# EasyEDA Pro project 可调电源.eprj, board PCB1
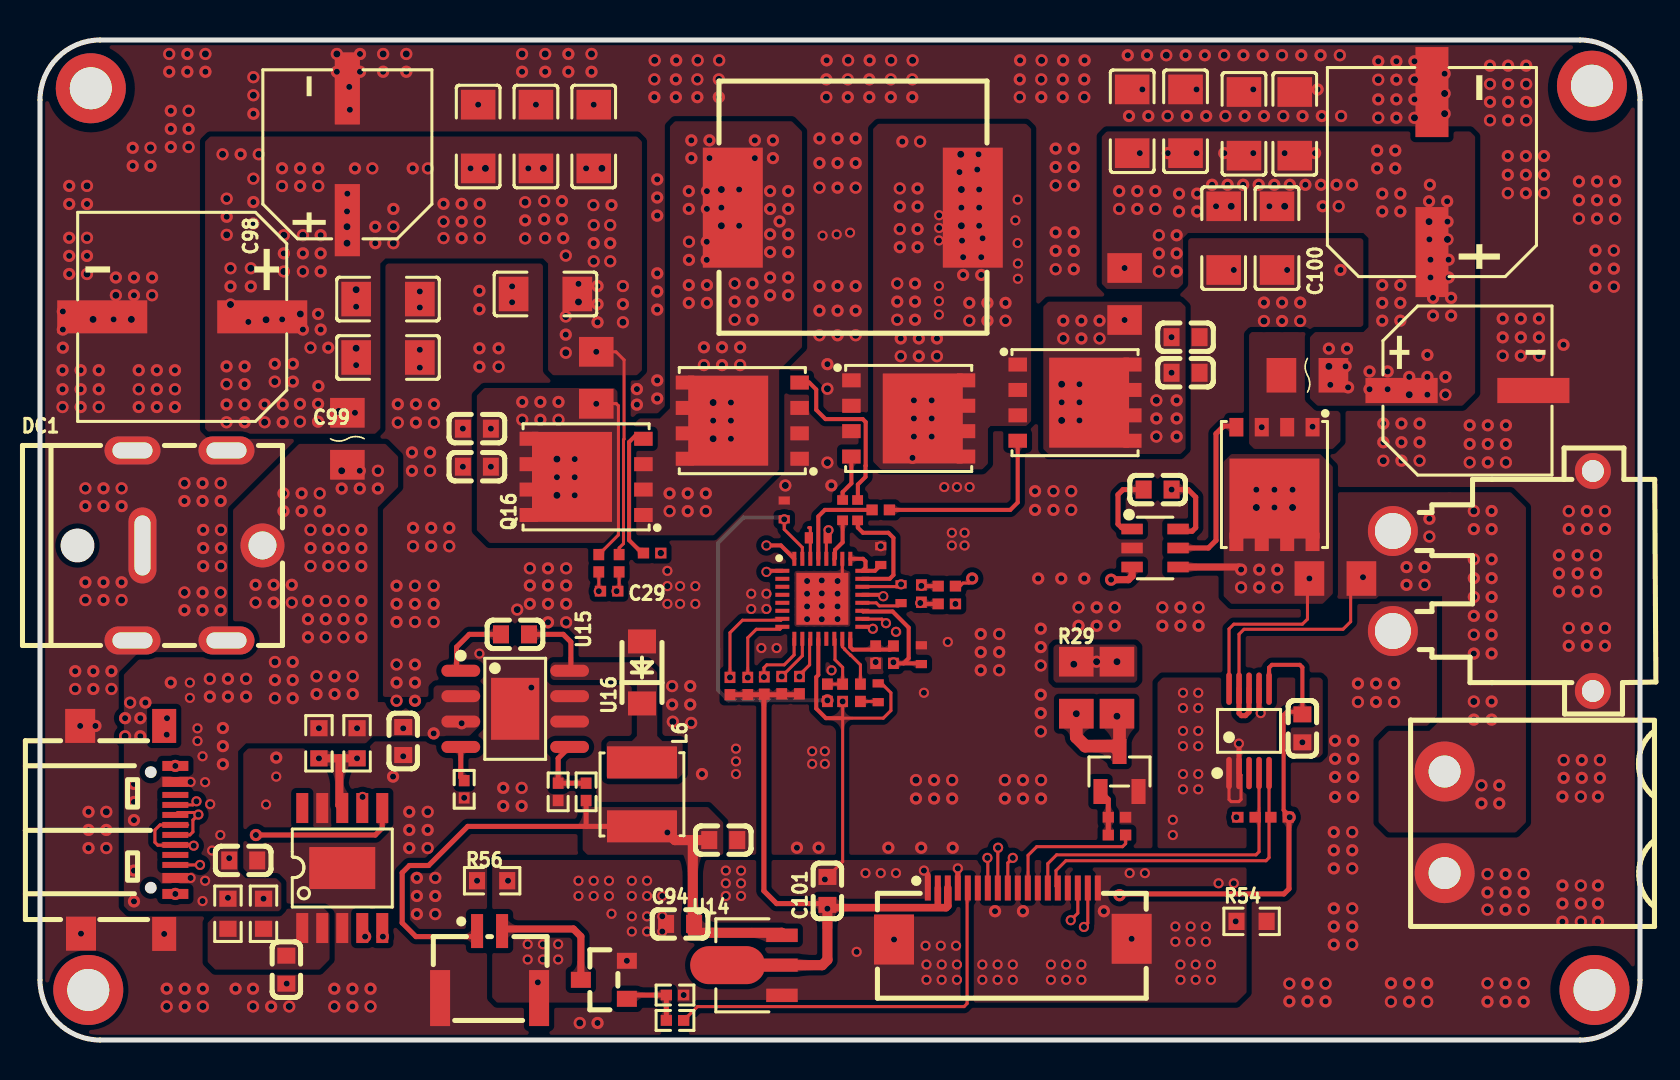
[diagram p2: board, top side]
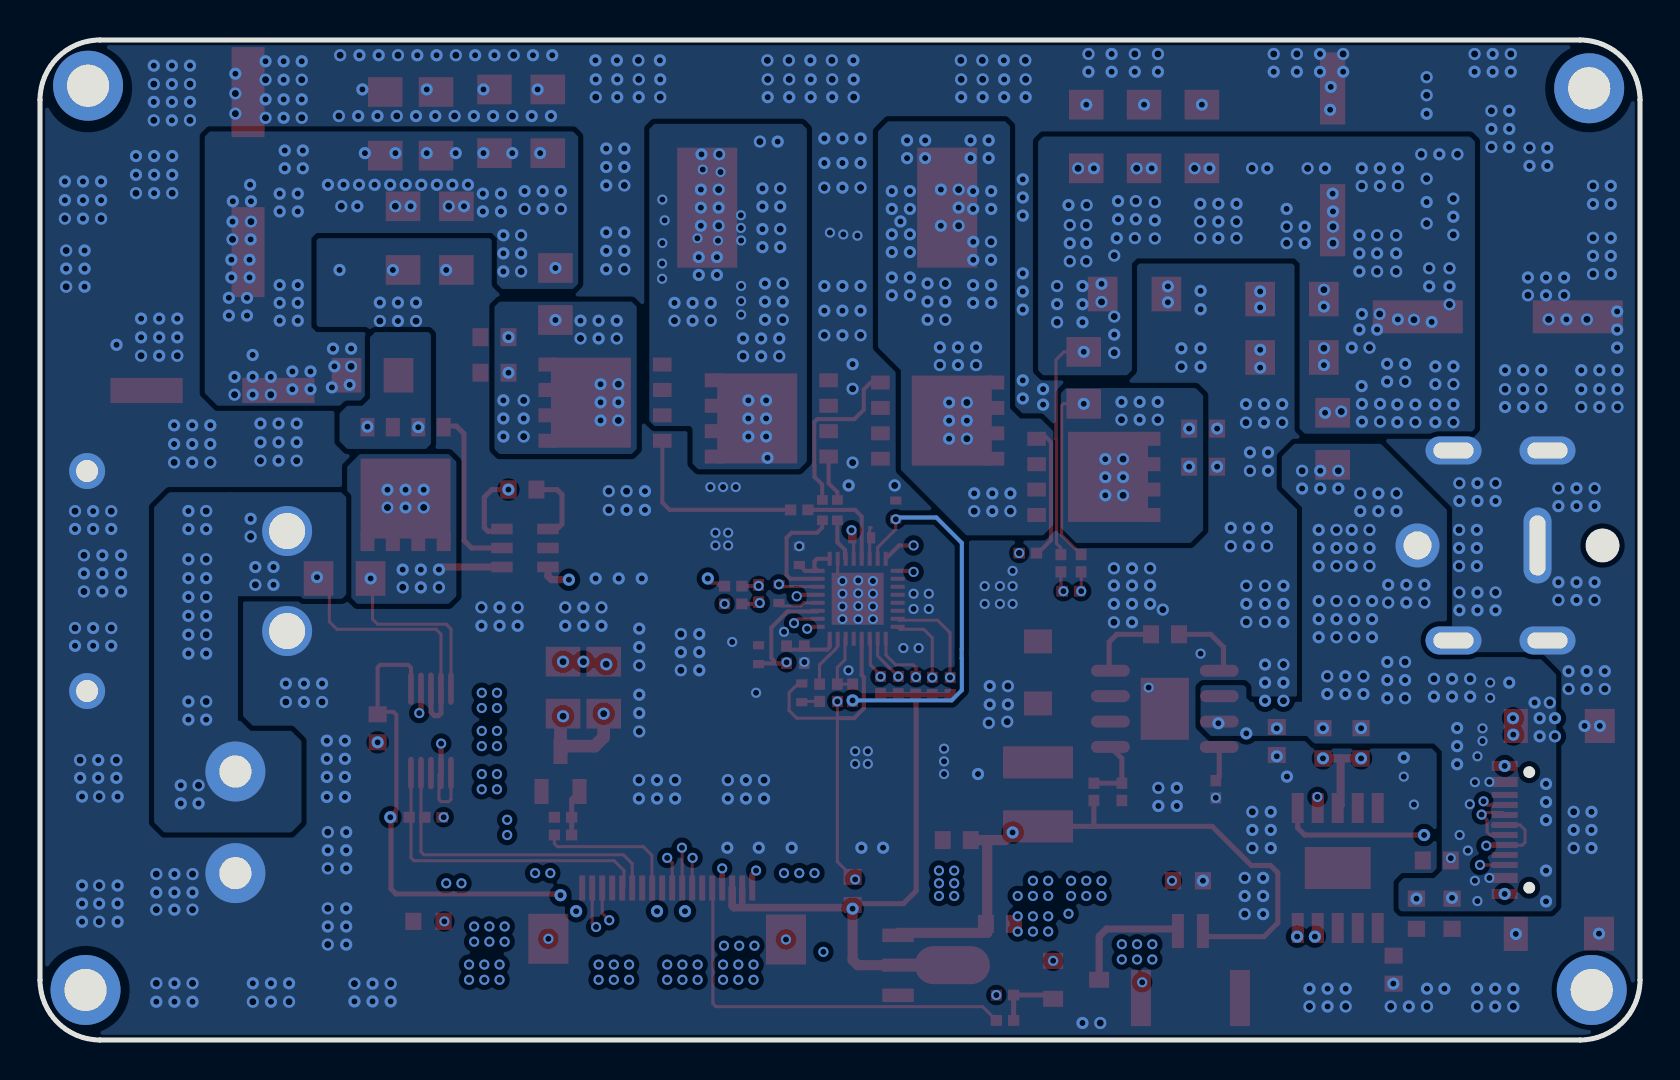
[diagram p3: board, bottom side, seen from below]

Outline 80 x 50 mm; copper layers: Top Layer, 内层1, 内层2, Bottom Layer. Coordinates in mm from the lower left corner of the outline.
Outline path: 0,47 0,3 arc(0.88,0.88) 3,0 77,0 arc(79.12,0.88) 80,3 80,47 arc(79.12,49.12) 77,50 3,50 arc(0.88,49.12) 0,47
Stack: Top Layer 0.035mm 外层铜厚1oz / Dielectric1 0.2104mm 7628 RC49% 8.6mil / 内层1 0.0152mm 内层铜厚 / Dielectric2 1.065mm 1.1mm H/HOZ Copper / 内层2 0.0152mm 内层铜厚 / Dielectric3 0.2104mm 7628 RC49% 8.6mil / Bottom Layer 0.035mm 外层铜厚1oz

## Design rules (mm)
template: 自定义配置
spacing copperThickness1oz (default): track to track 0.102, other pairs 0.152 to 0.3
spacing copperThickness2oz: track to track 0.203, other pairs 0.152 to 0.3
track width copperThickness1oz (default): min 0.127, default 0.254, max 2.54
track width copperThickness2oz: min 0.203, default 0.254, max 2.54
differential pair differentialPair (default): width min 0.127, default 0.254, max 2.54; gap min 0.152, default 0.152
via viaSize (default): diameter min 0.5, default 0.61, max 10; hole min 0.3, default 0.305, max 6.3

## Placement (name value [footprint] x y rotation side)
C28  100nF  [C0402]  44.07 22.31 90 top
C29  100nF  [C0402]  28.45 22.44 0 top
C49  22uF  [C1206]  60.2 45.81 270 top
C50  22uF  [C1206]  57.28 45.94 270 top
C51  22uF  [C1206]  62.74 45.81 270 top
C52  22uF  [C1206]  61.85 40.09 270 top
C53  22uF  [C1206]  59.18 40.09 270 top
C55  22uF  [C1206]  25.27 37.3 0 top
C56  22uF  [C1206]  17.4 34.12 180 top
C57  22uF  [C1206]  17.4 37.05 180 top
C58  22uF  [C1206]  24.8 45.17 90 top
C59  22uF  [C1206]  27.69 45.17 90 top
C60  22uF  [C1206]  21.91 45.17 90 top
C66  100uF  [CAP-SMD_BD8.0-L8.3-W8.3-LS9.0-FD]  71.37 32.47 0 top
C68  100nF  [C0603]  63.12 15.58 90 top
C69  100nF  [C0603]  12.32 3.52 90 top
C76  100nF  [C0603]  21.84 30.57 0 top
C77  100nF  [C0603]  21.84 28.66 0 top
C78  100nF  [C0603]  57.28 33.36 180 top
C79  100nF  [C0603]  57.28 35.14 180 top
C80  100nF  [C0402#2]  43.05 22.31 90 top
C81  1uF  [C0402#2]  44.07 19.27 90 top
C83  100nF  [C0402#2]  38.91 25.11 0 top
C84  22nf  [C0402#2]  41.91 17.36 270 top
C85  1uF  [C0402#2]  37.21 26.5 90 top
C87  100nF  [C0603]  55.88 27.52 180 top
C88  2.2uF  [C0402#2]  42.04 24.22 90 top
C91  22uF  [C1206]  54.61 45.94 270 top
C92  100nF  [C0603]  10.16 8.98 0 top
C94  1uf  [C0603]  32 5.8 0 top
C98  100uF  [CAP-SMD_BD8.0-L8.3-W8.3-LS9.0-FD]  15.37 44.28 90 top
C99  220uF  [CAP-SMD_BD10.0-L10.3-W10.3-FD-1]  7.11 36.16 180 top
C100  220uF  [CAP-SMD_BD10.0-L10.3-W10.3-FD-1]  69.6 43.4 90 top
C101  100nF  [C0603]  39.37 7.45 90 top
C102  4.7uF  [C0603]  18.16 14.95 90 top
C103  100nF  [C0603]  23.75 20.28 0 top
C104  10uF  [C0603]  34.16 10 180 top
CN1  XT30PW-M30.G.Y  [CONN-TH_XT30PW-M]  72.64 22.95 90 top
CN2  WAFER-GH1.25-2PLB  [CONN-TH_2P-P1.25_XUNPU_WAFER-GH1.25-2PLB]  22.48 3.77 0 top
CN3  WJ2EDGR-5.08-2P  [CONN-TH_WJ2EDGR-5.08-2P]  70.23 10.88 90 top
DC1  DC007B-2.5  [DC-IN-TH_HX-DC007B-2.5]  7.87 24.73 0 top
F1  1206C_63V_15A  [F1206]  63.37 33.24 0 top
F2  1206C_63V_15A  [F1206]  15.37 30.06 270 top
FPC1  FPC-05F-18PH20  [FPC-SMD_18P-P0.50_FPC-05F-18PH20]  48.64 6.31 0 top
L4  4.7uH  [IND-SMD_L13.45-W12.6]  40.64 41.62 180 top
L6  15uH  [IND-SMD_L4.0-W4.0]  30.1 12.28 270 top
NOREF  -  [Pad_e3715]  77.72 2.5 270 top
NOREF#2  -  [Pad_e104]  2.41 2.5 270 top
NOREF#3  -  [Pad_e103]  2.54 47.59 270 top
NOREF#4  -  [Pad_e2350]  77.6 47.71 270 top
Q13  -  [S8050_SOT-23]  28.19 2.88 0 top
Q15  AO3400A  [SOT-23-3_L2.9-W1.3-P1.90-LS2.4-BR]  53.97 13.42 270 top
Q16  AON6260  [PG-TDSON-8_L5.9-W5.2-P1.27-LS6.2-BL-EP]  27.31 28.16 90 top
Q17  AON6260  [PG-TDSON-8_L5.9-W5.2-P1.27-LS6.2-BL-EP]  35.12 30.97 90 top
Q18  AON6260  [PG-TDSON-8_L5.9-W5.2-P1.27-LS6.2-BL-EP]  43.43 31.08 270 top
Q19  AON6260  [PG-TDSON-8_L5.9-W5.2-P1.27-LS6.2-BL-EP]  51.75 31.87 270 top
Q21  AON6260  [PG-TDSON-8_L5.9-W5.2-P1.27-LS6.2-BL-EP]  61.72 27.78 180 top
R1  11.2K  [R0402#2]  21.21 12.53 90 top
R4  5mΩ  [R1206]  54.23 37.3 270 top
R5  5mΩ  [R1206]  27.81 33.11 90 top
R6  10Ω  [R0402#2]  45.34 21.81 0 top
R7  10Ω  [R0402#2]  45.34 22.69 0 top
R8  10Ω  [R0402#2]  27.94 23.84 90 top
R9  10Ω  [R0402#2]  28.96 23.84 90 top
R11  2Ω  [R0402#2]  42.04 26.5 180 top
R12  2Ω  [R0402#2]  30.61 24.35 180 top
R13  2Ω  [R0402]  40.13 26.5 270 top
R24  270kΩ  [R0402#2]  42.67 19.27 270 top
R26  10kΩ  [R0402#2]  41.02 17.36 90 top
R27  15kΩ  [R0402#2]  41.78 19.27 90 top
R28  100K  [R0402#2]  39.37 17.36 270 top
R29  300Ω  [R1206]  51.82 17.61 90 top
R30  300Ω  [R1206]  53.85 17.61 90 top
R31  5.6K  [R0402#2]  40.13 17.36 90 top
R33  5mΩ  [R1206]  64.77 23.08 180 top
R34  20K  [R0603]  13.95 14.84 270 top
R35  20K  [R0603]  15.85 14.84 270 top
R36  2K  [R0603]  9.4 6.31 90 top
R37  2K  [R0603]  11.18 6.31 90 top
R38  10K  [R0402#2]  34.5 17.7 270 top
R39  10K  [R0402#2]  35.39 17.7 270 top
R40  10K  [R0402#2]  36.22 17.72 270 top
R41  10K  [R0402#2]  37.97 17.74 270 top
R42  10K  [R0402#2]  37.08 17.74 270 top
R49  10K  [R0402#2]  53.85 11.14 180 top
R51  1K  [R0402#2]  53.85 10.25 0 top
R52  10K  [R0402#2]  31.75 2.25 0 top
R53  1K  [R0402#2]  31.75 0.98 180 top
R54  0R  [R0603]  60.58 5.93 0 top
R56  0R  [R0603]  22.61 7.96 180 top
R59  4.7K  [R0402#2]  60.32 11.14 0 top
R60  4.7K  [R0402#2]  61.98 11.14 180 top
R61  2Ω  [R0402]  40.89 26.48 90 top
R62  56K  [R0402#2]  27.31 12.41 270 top
R63  10K  [R0402#2]  25.91 12.41 90 top
U6  SC8815QDER  [QFN-32_L4.0-W4.0-P0.40-BL-EP2.7]  39.12 22.06 270 top
U8  INA226AIDGSR  [MSOP-10_L3.0-W3.0-P0.50-LS5.0-BL]  60.45 15.46 0 top
U9  CH224K  [ESSOP-10_L4.9-W3.9-P1.0-LS6.0-TL-EP]  15.11 8.6 0 top
U13  LM74700QDBVRQ1  [SOT-23-6_L2.9-W1.6-P0.95-LS2.8-BL]  55.75 24.6 270 top
U14  SCJA1117B-3.3-A  [SOT-89-3L_L4.5-W2.5-P1.50-LS4.1-BR]  35.74 3.73 0 top
U15  LMR16020PDDAR  [SOIC-8_L4.9-W3.9-P1.27-LS6.0-BL-EP]  23.76 16.56 270 top
U16  SS24FL  [SOD-123FL_L2.8-W1.8-LS3.6-RD]  30.1 18.38 90 top
USB1  TYPE-C 16P QTWT  [USB-TYPE-C-SMD_TYPE-C-16P-QTWT]  4.32 10.5 270 top

## Footprints (pads in the part's own frame, mm; a bottom-side part is the same pattern mirrored in y, then rotated)
C0402
  rect 0.566x0.54 smd: 1(-0.424,0) 2(0.441,0)
C0402#2
  rect 0.41x0.56 smd: 1(-0.47,0) 2(0.47,0)
C0603
  rect 0.8x0.9 smd: 1(-0.7,0) 2(0.7,0)
C1206
  rect 1.485x1.728 smd: 1(-1.593,0) 2(1.593,0)
CAP-SMD_BD8.0-L8.3-W8.3-LS9.0-FD
  rect 3.61x1.26 smd: 1(-3.295,0) 2(3.295,0)
CAP-SMD_BD10.0-L10.3-W10.3-FD-1
  rect 4.5x1.65 smd: 1(-4,0) 2(4,0)
CONN-TH_2P-P1.25_XUNPU_WAFER-GH1.25-2PLB
  rect 0.6x1.7 smd: 1(-0.625,1.675) 2(0.625,1.675)
  rect 1x2.8 smd: 3(2.475,-1.675) 4(-2.475,-1.675)
CONN-TH_WJ2EDGR-5.08-2P
  round 3 hole 1.6: 1(-2.54,0) 2(2.54,0)
CONN-TH_XT30PW-M
  round 2.5 hole 1.8: 1(-2.5,5) 2(2.5,5)
  round 1.8 hole 1.1: 3(5.5,-5) 4(-5.5,-5)
DC-IN-TH_HX-DC007B-2.5
  round 2.2 hole 1.4: 1(3.25,0)
  oval 1.4x3.8 hole 0.8x3: 2(-2.75,0)
  oval 2.8x1.4 hole 2x0.8: 3(-3.25,4.75) 3(-3.25,-4.75) 3(1.45,4.75) 3(1.45,-4.75)
ESSOP-10_L4.9-W3.9-P1.0-LS6.0-TL-EP
  rect 0.6x1.5 smd: 1(-2,-3) 2(-1,-3) 3(0,-3) 4(1,-3) 5(2,-3) 6(2,3) 7(1,3) 8(0,3) 9(-1,3) 10(-2,3)
  rect 3.3x2.1 smd: 11(0,0)
F1206
  rect 1.485x1.728 smd: 1(-1.3,0) 2(1.3,0)
FPC-SMD_18P-P0.50_FPC-05F-18PH20
  rect 0.3x1.25 smd: 1(-4.25,1.288) 2(-3.75,1.288) 3(-3.25,1.288) 4(-2.75,1.288) 5(-2.25,1.288) 6(-1.75,1.288) 7(-1.25,1.288) 8(-0.75,1.288) 9(-0.25,1.288) 10(0.25,1.288) 11(0.75,1.288) 12(1.25,1.288) 13(1.75,1.288) 14(2.25,1.288) 15(2.75,1.288) 16(3.25,1.288) 17(3.75,1.288) 18(4.25,1.288)
  rect 2x2.5 smd: 19(-5.94,-1.288) 20(5.94,-1.252)
IND-SMD_L4.0-W4.0
  rect 1.6x3.5 smd: 1(-1.6,0) 2(1.6,0)
IND-SMD_L13.45-W12.6
  rect 3x6 smd: 1(-6,0) 2(6,0)
MSOP-10_L3.0-W3.0-P0.50-LS5.0-BL
  oval 0.28x1.62 smd: 1(-1,-2.11) 2(-0.5,-2.11) 3(0,-2.11) 4(0.5,-2.11) 5(1,-2.11) 6(1,2.11) 7(0.5,2.11) 8(0,2.11) 9(-0.5,2.11) 10(-1,2.11)
Pad_e103
  round 3.5 hole 2.1: 1(0,0)
Pad_e104
  round 3.5 hole 2.1: 1(0,0)
Pad_e2350
  round 3.5 hole 2.1: 1(0,0)
Pad_e3715
  round 3.5 hole 2.1: 1(0,0)
PG-TDSON-8_L5.9-W5.2-P1.27-LS6.2-BL-EP
  rect 0.7x0.925 smd: 1(-1.905,-2.865) 2(-0.635,-2.865) 3(0.635,-2.865) 4(1.905,-2.865) 5(1.905,2.865) 6(0.635,2.865) 7(-0.635,2.865) 8(-1.905,2.865)
  rect 4.5x4 smd: 9(0.001,0.705)
QFN-32_L4.0-W4.0-P0.40-BL-EP2.7
  rect 0.2x0.7 smd: 1(-1.4,-2) 2(-1,-2) 3(-0.6,-2) 4(-0.2,-2) 5(0.2,-2) 6(0.6,-2) 7(1,-2) 8(1.4,-2) 17(1.4,2) 18(1,2) 19(0.6,2) 20(0.2,2) 21(-0.2,2) 22(-0.6,2) 23(-1,2) 24(-1.4,2)
  rect 0.7x0.2 smd: 9(2,-1.4) 10(2,-1) 11(2,-0.6) 12(2,-0.2) 13(2,0.2) 14(2,0.6) 15(2,1) 16(2,1.4) 25(-2,1.4) 26(-2,1) 27(-2,0.6) 28(-2,0.2) 29(-2,-0.2) 30(-2,-0.6) 31(-2,-1) 32(-2,-1.4)
  rect 2.6x2.6 smd: 33(0,0)
R0402
  rect 0.48x0.54 smd: 1(-0.495,0.013) 2(0.52,0.013)
R0402#2
  rect 0.566x0.54 smd: 1(-0.433,0) 2(0.433,0)
R0603
  rect 0.806x0.864 smd: 1(-0.753,0) 2(0.753,0)
R1206
  rect 1.485x1.728 smd: 1(-1.3,0) 2(1.3,0)
S8050_SOT-23
  rect 1x0.8 smd: 1(1.15,-0.823) 2(1.15,1.077) 3(-1.15,0.127)
SOD-123FL_L2.8-W1.8-LS3.6-RD
  rect 1.2x1.4 smd: 1(-1.55,0) 2(1.55,0)
SOIC-8_L4.9-W3.9-P1.27-LS6.0-BL-EP
  oval 0.602x1.941 smd: 1(-1.905,-2.72) 2(-0.635,-2.72) 3(0.635,-2.72) 4(1.905,-2.72) 5(1.905,2.72) 6(0.635,2.72) 7(-0.635,2.72) 8(-1.905,2.72)
  rect 3.098x2.41 smd: 9(0,0)
SOT-23-3_L2.9-W1.3-P1.90-LS2.4-BR
  rect 1.25x0.7 smd: 1(1,-0.95) 2(1,0.95) 3(-1,0)
SOT-23-6_L2.9-W1.6-P0.95-LS2.8-BL
  rect 0.532x1.072 smd: 1(-0.95,-1.149) 2(0,-1.149) 3(0.95,-1.149) 4(0.95,1.149) 5(0,1.149) 6(-0.95,1.149)
SOT-89-3L_L4.5-W2.5-P1.50-LS4.1-BR
  rect 1.575x0.672 smd: 1(1.356,-1.5) 3(1.356,1.5)
  custom 5.377x1.9 smd: 2(-1.356,0.009)
USB-TYPE-C-SMD_TYPE-C-16P-QTWT
  rect 1.7x1.2 smd: 0(-5.2,1.891) 0(5.2,1.891)
  rect 1.7x1.5 smd: 0(-5.2,-2.309) 0(5.185,-2.268)
  rect 0.5x1.3 smd: A1(-3.2,2.449) A4(-2.4,2.449) A9(2.4,2.449) A12(3.2,2.449)
  rect 0.3x1.3 smd: A5(-1.25,2.448) A6(-0.25,2.448) A7(0.25,2.448) A8(1.25,2.449) B5(1.75,2.448) B6(0.75,2.448) B7(-0.75,2.448) B8(-1.75,2.449)

## Nets
As in the schematic.

Pads without a net: NOREF 1; NOREF#2 1; NOREF#3 1; NOREF#4 1; U6 2 3 4 5 6 13; U8 3; U9 10; USB1 A8 B8

## Via types
v1: diameter 0.508, hole 0.33, Top Layer to Bottom Layer, 4 vias
v2: diameter 0.508, hole 0.305, Top Layer to Bottom Layer, 207 vias
v3: diameter 0.61, hole 0.305, Top Layer to Bottom Layer, 773 vias
v4: diameter 0.61, hole 0.355, Top Layer to Bottom Layer, 307 vias

## Routing (per net, layer and track width the routed paths; a pad name or vN(x,y) marks a point on that pad's centre or on a via; arc(x,y) is an arc through that point)
3V3: length 73.7
  Top Layer w0.152: R59.1 v2(59.82,11.14)
  Top Layer w0.203: U8.6 61.45,18.61 61.59,18.76 62.99,18.76 63.12,18.63 C68.2 62.99,16.41 62.33,16.41 62.18,16.26 62.18,11.49 62.41,11.27 R60.1
  Top Layer w0.254: R38.2 R39.2 36.19,17.26 ; v3(53.97,7.24) 54.04,7.3 62.2,7.3 62.45,7.56 62.45,11.1 R60.1 ; 36.19,17.26 36.19,17.27 R40.2 ; 36.19,17.26 36.19,7.45 36.83,6.82 39.05,6.82 39.31,6.57 v3(39.37,6.57) ; 36.19,17.26 37.93,17.26 R41.2
  Top Layer w0.33: 44.89,6.81 FPC1.2
  Top Layer w0.381: FPC1.3 45.39,6.7 45.3,6.62 39.42,6.62 v3(39.37,6.57)
  Top Layer w0.508: U14.2 39.11,3.74 39.37,4.01 v3(39.37,6.57)
  内层1 w0.305: v2(59.82,11.14) v3(62.48,11.14) ; v3(53.97,7.24) 53.76,7.45 40.26,7.45 v3(39.37,6.57)
+5V: length 68.8
  Top Layer w0.254: 27.33,10.68 21.39,10.68 19.43,8.72 18.47,8.72 18.11,8.36 18.11,5.86 18.8,5.17 21.58,5.17 CN2.1 ; 27.33,10.68 27.31,10.71 R62.2 ; 27.33,10.68 30.1,10.68
  Top Layer w0.355: v3(53.55,23.02) 54.42,23.02 54.6,23.2 U13.3
  Top Layer w0.508: 32.64,10 32.64,5.36 37.08,5.36 37.17,5.27 ; 32.64,10 31.75,10 v3(31.37,10.38) ; 32.64,10 C104.2
  内层1 w0.203: v3(31.37,10.38) 33.4,10.38 33.91,10.88 33.91,18.48 34.11,18.68 38.43,18.68 39.24,17.87 44.45,17.87 44.83,18.25 44.83,22.19 44.96,22.31 52.85,22.31 v3(53.55,23.02)
GND: length 26.6
  Top Layer w0.152: U8.2 60.05,13.25 60.05,12.03 59.94,11.92 59.56,11.92 59.45,12.03 U8.1 ; 40.13,16.09 42.16,16.09 42.54,16.47 42.54,17.36 42.07,17.83 C84.1 ; 40.13,16.09 40.13,8.92 v2(39.24,8.03) ; 40.13,16.09 v2(40.13,16.93)
  Top Layer w0.203: U6.12 38.92,18.25 38.81,18.15 38.81,16.58 39.29,16.09 40.13,16.09
  Top Layer w0.254: FPC1.1 44.39,8.28 v2(44.2,8.47) ; U8.7 60.95,16.34 ; U8.2 59.95,14.81 v2(59.94,14.82) ; FPC1.4 v2(45.89,8.58)
  vias: v2(23.4,7.96) v2(24.38,4.79) v2(24.38,4.03) v2(24.89,2.88) v2(25.15,4.79) v2(25.15,4.03) v2(25.91,4.79) v2(25.91,4.03) v2(26.92,7.96) v2(26.92,7.2) v2(27.69,7.96) v2(27.69,7.2) v2(28.45,7.96) v2(28.45,7.2) v2(28.57,6.31) v2(29.34,3.96) v2(29.59,7.96) v2(29.59,7.2) v2(29.59,6.19) v2(29.59,5.42) v2(30.35,7.96) v2(30.35,7.2) v2(30.35,6.19) v2(30.35,5.42) v2(31.12,7.2) v2(31.12,6.19) v2(31.12,5.42) v2(32.18,2.25) v2(34.29,8.47) v2(34.29,7.84) v2(34.29,7.2) v2(35.05,8.47) v2(35.05,7.84) v2(35.05,7.2) v2(40.83,4.41) v2(41.28,8.34) v2(42.04,8.34) v2(42.7,5.02) v2(42.8,8.34) v2(44.28,4.71) v2(44.32,3.77) v2(44.32,3.01) v2(45.04,4.71) v2(45.09,3.77) v2(45.09,3.01) v2(45.8,4.71) v2(45.85,3.77) v2(45.85,3.01) v2(47.12,3.77) v2(47.12,3.01) v2(47.88,3.77) v2(47.88,3.01) v2(48.64,3.77) v2(48.64,3.01) v2(50.55,3.77) v2(50.55,3.01) v2(51.31,3.77) v2(51.31,3.01) v2(52.07,3.77) v2(52.07,3.01) v2(54.48,8.34) v2(54.58,5.06) v2(55.25,8.34) v2(56.64,11.01) v2(56.64,10.25) v2(56.77,5.68) v2(56.77,4.92) v2(57.02,3.77) v2(57.02,3.01) v2(57.15,17.36) v2(57.15,16.6) v2(57.15,15.46) v2(57.15,14.69) v2(57.15,13.3) v2(57.15,12.53) v2(57.53,5.68) v2(57.53,4.92) v2(57.78,3.77) v2(57.78,3.01) v2(57.91,17.36) v2(57.91,16.6) v2(57.91,15.46) v2(57.91,14.69) v2(57.91,13.3) v2(57.91,12.53) v2(58.29,5.68) v2(58.29,4.92) v2(58.55,3.77) v2(58.55,3.01) v2(58.93,7.84) v2(59.69,7.84) v2(59.78,5.93) v2(61.04,16.34) v3(47.75,6.44) v3(49.15,6.44) v3(53.19,6.44) v3(63.12,14.88)
PGND: length 1.2
  Top Layer w0.152: v2(39.88,22.95) 40.12,23.19 U6.26
  vias: v2(11.3,11.77) v2(11.81,13.17) v2(21.21,12.11) v2(21.97,19.32) v2(24.57,17.62) v2(31.37,23.46) v2(31.37,22.69) v2(31.37,21.81) v2(32,22.69) v2(32,21.81) v2(32.77,22.69) v2(32.77,21.81) v2(34.8,14.57) v2(34.8,13.93) v2(34.8,13.3) v2(35.56,22.31) v2(35.56,21.55) v2(36.07,19.6) v2(36.32,22.31) v2(36.32,21.55) v2(36.83,19.6) v2(38.35,22.95) v2(38.35,22.31) v2(38.35,21.68) v2(38.35,21.04) v2(38.61,14.44) v2(38.61,13.81) v2(39.13,40.22) v2(39.09,22.98) v2(39.09,22.33) v2(39.09,21.7) v2(39.09,21.04) v2(39.24,14.44) v2(39.24,13.81) v2(39.58,18.48) v2(39.83,40.28) v2(39.88,22.31) v2(39.88,21.68) v2(39.88,21.04) v2(40.5,40.37) v2(41.78,18.9) v2(42.04,24.69) v2(42.8,20.41) v2(44.2,17.36) v2(45.21,27.65) v2(45.39,19.9) v2(45.59,25.36) v2(45.59,24.73) v2(45.85,27.65) v2(46.23,25.36) v2(46.23,24.73) v2(46.48,27.65) v3(1.14,36.43) v3(1.14,35.52) v3(1.14,34.62) v3(1.13,33.49) v3(1.13,32.54) v3(1.46,42.71) v3(1.46,41.8) v3(1.46,40.11) v3(1.46,39.2) v3(1.46,38.3) v3(1.76,18.44) v3(2.03,33.49) v3(2.03,32.54) v3(2.03,31.65) v3(2.01,15.7) v3(2.05,5.32) v3(2.35,41.8) v3(2.35,39.2) v3(2.27,26.7) v3(2.27,22.89) v3(2.43,11.41) v3(2.43,10.5) v3(2.43,9.6) v3(2.67,18.44) v3(2.67,17.55) v3(2.77,15.7) v3(2.94,33.49) v3(2.94,32.54) v3(3.17,27.58) v3(3.17,26.7) v3(3.17,22.89) v3(3.17,22) v3(3.32,10.5) v3(3.57,18.44) v3(3.68,36.03) v3(3.79,38.13) v3(4.08,26.7) v3(4.08,22.89) v3(4.64,44.61) v3(4.64,43.71) v3(4.7,38.13) v3(4.7,37.24) v3(4.94,33.49) v3(4.94,31.65) v3(5.52,43.71) v3(5.6,38.13) v3(5.84,33.49) v3(5.84,32.54) v3(5.84,31.65) v3(6.21,5.3) v3(6.35,16.09) v3(6.34,15.27) v3(6.33,2.57) v3(6.46,48.41) v3(6.54,46.46) v3(6.54,45.56) v3(6.54,44.65) v3(6.75,33.49) v3(6.75,31.65) v3(6.77,13.7) v3(6.77,7.3) v3(7.22,26.95) v3(7.22,21.49) v3(7.24,2.57) v3(7.24,1.68) v3(7.37,49.3) v3(7.37,48.41) v3(7.43,45.56) v3(8.13,27.84) v3(8.13,26.95) v3(8.13,22.38) v3(8.13,21.49) v3(8.14,2.57) v3(8.16,25.51) v3(8.16,24.6) v3(8.16,23.69) v3(8.27,48.41) v3(9.03,26.95) v3(9.05,24.6) v3(9.03,21.49) v3(9.78,2.57) v3(10.67,46.31) v3(10.65,2.57) v3(11.56,1.68) v3(11.81,14.12) v3(12.34,2.82) v3(14.72,2.57) v3(14.84,48.41) v3(15.46,47.66) v3(15.49,46.51) v3(15.62,2.57) v3(15.62,1.68) v3(16,49.3) v3(16,48.41) v3(16.53,2.57) v3(17.16,48.41) v3(17.65,13.17) v3(17.83,22.71) v3(17.83,21.81) v3(17.83,20.9) v3(17.83,17.87) v3(17.89,31.79) v3(18.16,14.19) v3(18.31,48.41) v3(18.46,11.41) v3(18.46,10.5) v3(18.46,9.6) v3(18.6,29.38) v3(18.6,28.46) v3(18.65,25.61) v3(18.75,21.81) v3(18.75,18.77) v3(18.75,17.87) v3(18.75,16.96) v3(18.8,31.79) v3(18.8,30.87) v3(18.84,8.11) v3(18.84,7.2) v3(18.84,6.3) v3(18.99,37.43) v3(18.99,36.63) v3(18.99,34.51) v3(18.99,33.62) v3(19.38,10.5) v3(19.5,29.38) v3(19.56,25.61) v3(19.56,24.69) v3(19.7,31.79) v3(19.69,21.81) v3(19.76,7.2) v3(20.46,25.61) v3(21.14,30.57) v3(21.14,28.66) v3(21.91,46.77) v3(21.85,7.96) v3(21.97,37.46) v3(21.97,36.54) v3(21.97,34.59) v3(21.97,33.66) v3(22.93,34.59) v3(23.16,12.61) v3(23.16,11.7) v3(23.61,37.68) v3(23.61,36.89) v3(24.1,48.41) v3(24.08,11.7) v3(24.49,22.73) v3(24.49,21.81) v3(24.8,46.77) v3(25.26,48.41) v3(25.4,23.58) v3(25.4,22.73) v3(25.4,21.81) v3(25.4,20.89) v3(26.31,22.73) v3(26.31,21.81) v3(26.42,49.3) v3(26.42,48.41) v3(27.58,48.41) v3(27.69,46.77) v3(27.88,0.85) v3(29.84,32.55) v3(29.84,31.77) v3(30.72,47.14) v3(30.86,43.03) v3(30.86,42.13) v3(30.86,41.22) v3(30.86,38.33) v3(30.86,37.43) v3(30.86,36.52) v3(30.86,32.98) v3(30.86,32.08) v3(31.61,16.77) v3(31.81,48.98) v3(31.79,48.03) v3(31.79,47.14) v3(32.51,17.69) v3(32.51,16.77) v3(32.87,47.14) v3(33.1,13.3) v3(33.94,47.14) v3(37.85,9.61) v3(38.93,9.61) v3(38.97,45.08) v3(38.97,43.85) v3(38.97,37.7) v3(38.97,36.47) v3(39.33,48.98) v3(39.32,48.03) v3(39.37,33.79) v3(39.57,27.73) v3(39.88,45.08) v3(39.88,43.85) v3(39.88,42.62) v3(39.88,37.7) v3(39.88,36.47) v3(39.88,35.24) v3(40.39,47.14) v3(40.78,45.08) v3(40.78,43.85) v3(40.78,37.7) v3(40.78,36.47) v3(41.48,48.98) v3(41.47,48.03) v3(41.47,47.14) v3(42.42,9.61) v3(42.54,47.14) v3(43.62,47.14) v3(43.8,12.07) v3(44.06,9.61) v3(44.7,13) v3(44.7,12.07) v3(45.61,12.07) v3(45.64,9.61) v3(47.04,20.3) v3(47.04,19.39) v3(47.04,18.49) v3(47.96,19.39) v3(48.24,12.07) v3(49,48.98) v3(48.99,48.03) v3(49.15,13) v3(49.15,12.07) v3(49.75,27.44) v3(49.75,26.5) v3(49.91,23.08) v3(50.04,20.57) v3(50.04,19.65) v3(50.04,17.27) v3(50.04,16.34) v3(50.06,47.14) v3(50.05,12.07) v3(50.67,26.5) v3(50.78,44.57) v3(50.78,43.65) v3(50.78,40.38) v3(50.78,39.46) v3(51.14,48.03) v3(51.14,47.14) v3(51.06,23.08) v3(51.16,48.98) v3(51.69,44.57) v3(51.69,43.65) v3(51.69,42.73) v3(51.69,40.38) v3(51.69,39.46) v3(51.69,38.54) v3(51.93,20.71) v3(52.23,48.98) v3(52.21,48.03) v3(52.22,23.08) v3(52.83,21.63) v3(52.83,20.71) v3(53.74,20.71) v3(54.39,49.24) v3(54.45,46.2) v3(55.12,47.53) v3(55.35,49.24) v3(55.42,46.2) v3(56.12,20.71) v3(57.02,21.63) v3(57.02,20.71) v3(57.28,49.24) v3(57.34,46.2) v3(57.83,47.53) v3(57.93,20.71) v3(58.24,49.24) v3(58.31,46.2) v3(59.69,38.5) v3(60.17,49.24) v3(60.24,46.2) v3(60.66,47.53) v3(61.14,49.24) v3(61.2,46.2) v3(61.2,36.87) v3(62.1,36.87) v3(62.1,35.95) v3(62.36,38.5) v3(62.47,1.93) v3(63.01,36.87) v3(63.06,49.24) v3(63.13,46.2) v3(63.37,2.82) v3(63.37,1.93) v3(63.88,47.53) v3(64.03,49.24) v3(64.09,46.2) v3(64.28,1.93) v3(64.69,10.39) v3(64.69,9.49) v3(64.69,8.58) v3(64.69,6.58) v3(64.69,5.68) v3(64.69,4.77) v3(64.75,14.96) v3(64.75,14.06) v3(64.75,13.15) v3(64.75,12.15) v3(65.02,38.5) v3(65.61,9.49) v3(65.61,5.68) v3(65.66,14.96) v3(65.66,14.06) v3(65.66,13.15) v3(65.66,12.15) v3(65.9,17.82) v3(66.8,17.82) v3(66.8,16.9) v3(66.91,48.94) v3(66.91,47.03) v3(67.17,30.82) v3(67.17,29.89) v3(67.55,2.84) v3(67.71,17.82) v3(67.82,48.94) v3(67.82,48.02) v3(67.82,47.03) v3(67.82,46.11) v3(68.07,30.82) v3(68.07,29.89) v3(68.07,28.97) v3(68.45,2.84) v3(68.45,1.91) v3(68.72,48.94) v3(68.72,47.03) v3(68.98,30.82) v3(68.98,29.89) v3(69.36,2.84) v3(70.23,48.31) v3(71.48,30.74) v3(71.48,29.8) v3(72.39,30.74) v3(72.39,29.8) v3(72.39,28.88) v3(72.37,7.38) v3(72.37,1.91) v3(72.5,48.72) v3(72.5,46.9) v3(73.14,36.07) v3(73.14,35.13) v3(73.3,30.74) v3(73.3,29.8) v3(73.28,8.3) v3(73.28,7.38) v3(73.28,6.52) v3(73.28,2.84) v3(73.28,1.91) v3(73.41,48.72) v3(73.41,47.8) v3(73.41,46.9) v3(73.41,45.98) v3(73.39,44.2) v3(73.39,43.26) v3(74.04,36.07) v3(74.04,35.13) v3(74.04,34.21) v3(74.18,7.38) v3(74.18,1.91) v3(74.31,48.72) v3(74.31,46.9) v3(74.29,44.2) v3(74.29,43.26) v3(74.29,42.34) v3(74.95,36.07) v3(74.95,35.13) v3(75.2,44.2) v3(75.2,43.26) v3(75.95,24.24) v3(75.95,23.33) v3(75.95,22.42) v3(76.12,12.17) v3(76.12,7.73) v3(76.12,6.82) v3(76.12,5.91) v3(76.17,34.76) v3(76.18,13.11) v3(76.44,25.55) v3(76.44,19.71) v3(76.95,42.93) v3(76.95,41.99) v3(76.88,24.24) v3(76.88,23.33) v3(76.88,22.42) v3(77.04,6.82) v3(77.09,14) v3(77.09,13.11) v3(77.34,26.44) v3(77.34,25.55) v3(77.34,20.6) v3(77.34,19.71) v3(77.77,39.48) v3(77.77,38.57) v3(77.77,37.66) v3(77.8,23.33) v3(77.85,42.93) v3(77.85,41.99) v3(77.85,41.07) v3(77.9,12.17) v3(77.9,7.73) v3(77.9,6.82) v3(77.9,5.91) v3(77.99,13.11) v3(78.25,25.55) v3(78.25,19.71) v3(78.69,38.57) v3(78.76,42.93) v3(78.76,41.99) v4(1.13,31.65) v4(1.76,17.55) v4(2.35,42.71) v4(2.35,40.11) v4(2.35,38.3) v4(2.27,27.58) v4(2.27,22) v4(2.65,36.03) v4(2.94,31.65) v4(3.32,11.41) v4(3.32,9.6) v4(3.57,17.55) v4(3.79,37.24) v4(4.08,27.58) v4(4.08,22) v4(4.57,36.03) v4(4.94,32.54) v4(5.52,44.61) v4(5.6,37.24) v4(6.33,1.68) v4(6.46,49.3) v4(6.75,32.54) v4(7.22,27.84) v4(7.22,22.38) v4(7.43,46.46) v4(7.43,44.65) v4(8.14,1.68) v4(8.27,49.3) v4(9.03,27.84) v4(9.05,25.51) v4(9.05,23.69) v4(9.03,22.38) v4(10.67,48.14) v4(10.67,47.24) v4(10.65,1.68) v4(12.46,1.68) v4(14.72,1.68) v4(14.84,49.3) v4(16.53,1.68) v4(17.16,49.3) v4(17.83,18.77) v4(17.83,16.96) v4(17.89,30.87) v4(18.31,49.3) v4(18.65,24.69) v4(18.75,22.71) v4(18.75,20.9) v4(19.38,11.41) v4(19.38,9.6) v4(19.5,28.46) v4(19.7,30.87) v4(19.69,22.71) v4(19.69,20.9) v4(19.76,8.11) v4(19.76,6.3) v4(20.46,24.69) v4(22.93,33.66) v4(23.86,21.52) v4(24.1,49.3) v4(24.08,12.61) v4(24.49,23.58) v4(25.26,49.3) v4(26.31,23.58) v4(26.31,20.89) v4(26.99,0.85) v4(27.58,49.3) v4(30.73,48.98) v4(30.72,48.03) v4(31.61,17.69) v4(31.64,15.92) v4(32.56,15.85) v4(32.88,48.98) v4(32.87,48.03) v4(33.94,48.03) v4(33.96,48.98) v4(37.27,27.73) v4(38.97,42.62) v4(38.97,35.24) v4(39.32,47.14) v4(39.37,32.56) v4(39.37,28.87) v4(40.41,48.98) v4(40.39,48.03) v4(40.78,42.62) v4(40.78,35.24) v4(42.54,48.03) v4(42.56,48.98) v4(43.63,48.98) v4(43.62,48.03) v4(43.8,13) v4(45.61,13) v4(47.96,20.3) v4(47.96,18.49) v4(48.24,13) v4(48.99,47.14) v4(50.04,18.73) v4(50.04,15.42) v4(50.08,48.98) v4(50.06,48.03) v4(50.05,13) v4(50.67,27.44) v4(50.78,42.73) v4(50.78,38.54) v4(51.56,27.44) v4(51.56,26.5) v4(51.93,21.63) v4(52.21,47.14) v4(53.74,21.63) v4(56.12,21.63) v4(56.32,49.24) v4(56.38,46.2) v4(57.93,21.63) v4(59.21,49.24) v4(59.27,46.2) v4(61.2,35.95) v4(62.1,49.24) v4(62.16,46.2) v4(62.47,2.82) v4(63.01,35.95) v4(64.28,2.82) v4(64.99,49.24) v4(65.06,46.2) v4(65.61,10.39) v4(65.61,8.58) v4(65.61,6.58) v4(65.61,4.77) v4(65.9,16.9) v4(66.91,48.02) v4(66.91,46.11) v4(67.17,28.97) v4(67.55,1.91) v4(67.71,16.9) v4(68.72,48.02) v4(68.72,46.11) v4(68.98,28.97) v4(69.36,1.91) v4(70.23,47.33) v4(70.23,46.32) v4(71.48,28.88) v4(72.37,8.3) v4(72.37,6.52) v4(72.37,2.84) v4(72.5,47.8) v4(72.5,45.98) v4(73.14,34.21) v4(73.3,28.88) v4(73.39,42.34) v4(74.18,8.3) v4(74.18,6.52) v4(74.18,2.84) v4(74.31,47.8) v4(74.31,45.98) v4(74.95,34.21) v4(75.2,42.34) v4(76.18,14) v4(76.44,26.44) v4(76.44,20.6) v4(76.95,41.07) v4(77.04,12.17) v4(77.04,7.73) v4(77.04,5.91) v4(77.8,24.24) v4(77.8,22.42) v4(77.99,14) v4(78.25,26.44) v4(78.25,20.6) v4(78.69,39.48) v4(78.69,37.66) v4(78.76,41.07)
VBUS: length 31
  Top Layer w0.203: 43.18,18.83 43.43,19.09 43.43,20.62 42.63,21.42 41.15,21.42 U6.19 ; 43.18,18.83 44.03,18.83 C81.1 ; 43.18,18.83 R24.2
  内层1 w0.229: 28.53,19.01 39.81,19.01 40.44,18.38 42.16,18.38 v2(42.67,18.89)
  内层1 w0.254: v3(21.08,15.84) 21.08,18.63 21.21,18.76 28.28,18.76 28.53,19.01
  vias: v2(7.49,17.87) v2(7.49,17.11) v2(7.53,12.9) v2(7.53,8.1) v2(7.87,15.58) v2(7.87,14.95) v2(8.13,14.19) v2(8.13,6.95) v2(8.25,12.89) v2(8.25,7.96) v2(8.51,11.79) v2(8.61,9.47) v2(9.02,10.25) v2(9.46,9.09) v3(4.25,16.09) v3(4.7,12.81) v3(4.7,11.9) v3(4.7,10.99) v3(4.7,8.47) v3(4.7,6.93) v3(5.02,16.09) v3(5.02,15.19) v3(5.27,16.87) v3(6.54,17.87) v3(8.49,17.17) v3(9.14,15.6) v3(9.14,14.69) v3(9.14,13.79) v3(9.4,18.06) v3(9.4,17.17) v3(9.4,7.11) v3(10.3,17.17) v3(10.78,22.76) v3(11.18,7.07) v3(11.68,22.76) v3(11.68,21.87) v3(11.75,18) v3(12.18,26.44) v3(12.59,22.76) v3(12.64,18.9) v3(12.64,18) v3(12.64,17.09) v3(13.08,27.33) v3(13.08,26.44) v3(13.4,21.95) v3(13.4,21.04) v3(13.4,20.14) v3(13.53,24.6) v3(13.83,17.3) v3(13.95,15.59) v3(13.99,26.44) v3(14.29,21.04) v3(14.41,25.51) v3(14.41,24.6) v3(14.41,23.69) v3(14.73,18.19) v3(14.73,17.3) v3(15.08,27.57) v3(15.18,24.6) v3(15.18,21.04) v3(15.64,17.3) v3(15.85,15.59) v3(15.99,28.46) v3(15.99,27.57) v3(16.07,25.51) v3(16.07,24.6) v3(16.07,23.69) v3(16.07,21.95) v3(16.07,21.04) v3(16.07,20.14) v3(16.89,27.57) v3(18.16,15.58) v3(19.69,15.33) v4(4.25,15.19) v4(4.51,16.87) v4(8.49,18.06) v4(10.3,18.06) v4(10.78,21.87) v4(11.75,18.9) v4(11.75,17.09) v4(12.18,27.33) v4(12.59,21.87) v4(13.53,25.51) v4(13.53,23.69) v4(13.83,18.19) v4(13.99,27.33) v4(14.29,21.95) v4(14.29,20.14) v4(15.08,28.46) v4(15.18,25.51) v4(15.18,23.69) v4(15.18,21.95) v4(15.18,20.14) v4(15.64,18.19) v4(16.89,28.46)
VIN+: length 12.4
  Top Layer w0.152: U8.10 59.45,20.55 59.69,20.79 63.12,20.79 63.37,21.04 63.37,22.98 v3(63.47,23.08)
  Top Layer w0.355: U13.4 59.93,23.65 v3(60.05,23.52)
  vias: v3(60.82,27.51) v3(60.96,23.52) v3(60.96,22.63) v3(61.72,27.51) v3(61.72,26.63) v3(61.87,23.52) v3(62.63,27.51) v4(60.05,22.63) v4(60.82,26.63) v4(61.87,22.63) v4(62.63,26.63)
VIN-: length 14.1
  Top Layer w0.152: v3(66.15,23.14) 65.53,22.52 65.53,20.92 65.15,20.54 60.2,20.54 59.95,20.29 U8.9
  Top Layer w0.254: U8.9 59.95,16.34 60.07,16.22 60.27,16.22 60.45,16.4 U8.8
  vias: v3(68.33,23.65) v3(68.33,22.76) v3(69.23,23.65) v3(69.47,26.06) v3(71.69,25.54) v3(71.69,23.09) v3(71.69,21.21) v3(71.69,19.32) v3(71.69,16.02) v3(72.07,11.83) v3(72.58,26.45) v3(72.58,25.54) v3(72.58,24.04) v3(72.58,23.09) v3(72.58,22.15) v3(72.58,21.21) v3(72.58,20.26) v3(72.58,19.32) v3(72.58,16.92) v3(72.58,16.02) v3(72.96,12.73) v3(72.96,11.83) v4(69.23,22.76) v4(69.47,25.17) v4(71.69,26.45) v4(71.69,24.04) v4(71.69,22.15) v4(71.69,20.26) v4(71.69,16.92) v4(72.07,12.73)
CC1: length 10.2
  Top Layer w0.152: USB1.A5 7.64,11.75 v2(7.82,11.94)
  Top Layer w0.254: v2(16.13,12.15) 16.13,11.61 U9.7
  内层1 w0.152: v2(16.13,12.15) 16,12.28 8.17,12.28 v2(7.82,11.94)
CC2: length 13
  Top Layer w0.152: USB1.B5 v2(8,8.75)
  Top Layer w0.254: v3(10.8,10.25) 16.76,10.25 17.11,10.6 U9.6
  内层1 w0.152: v2(8,8.75) 8.14,8.61 10.43,8.61 10.8,8.98 v3(10.8,10.25)
DN: length 17.7
  Top Layer w0.152: USB1.B7 6.89,11.38 7.82,11.38 v2(7.92,11.27) 7.64,11 7.64,10.41 7.49,10.25 7.39,10.25
  Top Layer w0.254: v3(17.14,5.17) 17.11,5.2 U9.5
  内层1 w0.152: v2(7.92,11.27) 16.12,11.27 17.14,10.25 v3(17.14,5.17)
DP: length 20
  Top Layer w0.152: USB1.B6 7.39,9.75 ; 7.39,9.75 7.65,9.75 v2(7.68,9.72) ; 7.39,9.75 7.38,9.74 5.89,9.74 5.75,9.88 5.75,10.5 6,10.75 7.39,10.75
  Top Layer w0.305: v3(16.26,5.17) 16.26,5.45 U9.4
  内层1 w0.152: v3(16.26,5.17) 16.26,10.5 15.88,10.88 8.85,10.88 v2(7.68,9.72)
FAN: length 20.3
  Top Layer w0.152: R53.1 32.87,1.67 46.2,1.67 46.35,1.82 46.35,7.56 FPC1.5
HD1: length 5
  Top Layer w0.203: U6.29 38.92,26.18 39.24,26.5 R11.2 41.66,26.45
HD2: length 13.8
  Top Layer w0.203: v1(42.16,22.19) 42.09,22.26 U6.21
  内层1 w0.203: v1(31.04,24.35) 31.42,23.97 41.66,23.97 42.16,23.46 v1(42.16,22.19)
INA_SCL: length 16.1
  Top Layer w0.152: U8.5 61.45,9.12 61.3,8.96 51.29,8.96 50.8,8.47 50.8,7.69 FPC1.14
INA_SDA: length 16
  Top Layer w0.152: U8.4 60.95,9.41 60.8,9.26 50.83,9.26 50.39,8.82 FPC1.13
LD1: length 2.2
  Top Layer w0.203: U6.27 39.75,24.09 39.75,24.5 40.13,24.88 40.13,26.07
LD2: length 5.9
  Top Layer w0.203: 40.89,26.07 40.89,25.62 41.15,25.36 42.42,25.36 42.67,25.11 42.67,23.25 42.49,23.06 U6.23
RELEASE: length 7.2
  Top Layer w0.152: FPC1.11 49.4,7.61 49.4,9.23 49.84,9.67 54.13,9.67 54.28,9.82 R51.2
SC_CE: length 36.8
  Top Layer w0.152: v2(34.5,18.13) 34.5,20.36 35.12,20.99 37.04,20.99 U6.7 ; FPC1.17 52.39,5.85 v2(52.2,5.65)
  内层1 w0.152: v2(52.2,5.65) 52.05,5.51 35.86,5.51 35.53,5.83 35.53,17.09 v2(34.5,18.13)
SC_INT: length 22.8
  Top Layer w0.152: v2(48.64,9.11) 48.39,8.86 FPC1.9 ; U6.11 38.48,20.03 38.48,18.76 37.97,18.25 R41.1
  内层1 w0.152: v2(48.64,9.11) 48.64,10 47.62,11.01 38.1,11.01 37.97,11.14 v2(37.97,18.17)
SC_PSTOP: length 33.8
  Top Layer w0.152: U6.8 36.99,20.54 35.81,20.54 35.39,20.11 R39.1 ; FPC1.16 51.89,6.34 v2(51.54,5.99)
  内层1 w0.152: v2(35.39,18.12) 35.81,17.7 35.81,6.08 36.09,5.8 51.35,5.8 v2(51.54,5.99)
SC_SCL: length 24.4
  Top Layer w0.152: v2(36.2,18.15) 36.2,18.61 36.34,18.76 37.21,18.76 37.7,19.25 37.7,20.05 U6.9 ; FPC1.7 47.39,9.09 v2(47.37,9.11)
  内层1 w0.152: v2(36.2,18.15) 36.2,10.4 36.35,10.25 46.86,10.25 47.37,9.74 v2(47.37,9.11)
SC_SDA: length 23.3
  Top Layer w0.152: v2(47.9,9.61) 47.89,9.6 FPC1.8 ; v2(37.08,18.17) 38.12,19.21 U6.10
  内层1 w0.152: v2(47.9,9.61) 47.9,10.1 47.37,10.63 37.24,10.63 37.08,10.78 v2(37.08,18.17)
SNS1N: length 12.5
  Top Layer w0.203: v1(36.32,24.73) 37.05,24.73 U6.32 ; R7.1 44.13,22.69 C28.2
  内层1 w0.152: v2(44.07,22.7) 44.07,24.47 43.37,25.17 41.08,25.17 40.64,24.73 v1(36.32,24.73)
SNS1P: length 11.4
  Top Layer w0.203: C28.1 44.15,21.81 R6.1 ; U6.1 36.38,23.46 v1(36.32,23.41)
  内层1 w0.152: v1(36.32,23.41) 36.32,23.66 36.35,23.69 41.25,23.69 41.67,23.26 41.67,21.84 41.82,21.7 43.61,21.7 43.76,21.85 v2(44.01,21.85)
SNS2N: length 15.7
  Top Layer w0.152: C29.2 28.96,22.51 R9.1 ; v2(41.64,20.56) 41.54,20.66 U6.17
  内层1 w0.152: v2(28.83,22.44) 28.83,21.55 29.82,20.56 38.88,20.56 38.89,20.56 39.29,20.56 39.29,20.56 v2(41.64,20.56)
SNS2P: length 19
  Top Layer w0.152: v2(42.3,20.84) 42.1,21.04 41.13,21.04 U6.18 ; R8.1 v2(27.94,22.44)
  内层1 w0.152: v2(42.3,20.84) 42.3,20.41 41.97,20.08 28.9,20.08 27.94,21.04 v2(27.94,22.44)
SW1: length 8.8
  Top Layer w0.152: v2(39.42,25.49) 39.32,25.38 U6.28
  内层1 w0.152: v2(39.42,25.49) 39.93,26 43.31,26 43.43,26.12 43.43,28.92 v3(43.62,29.11)
  vias: v2(44.95,39.97) v2(44.95,37.7) v2(44.95,36.95) v2(44.95,36.27) v2(44.96,41.24) v2(44.96,40.6) v2(45.97,43.4) v2(46.1,39.97) v2(46.86,43.52) v2(47.13,40.09) v2(48.77,40.98) v2(48.88,42.02) v2(48.88,39.85) v2(48.9,38.82) v2(48.9,38.06) v3(42.86,36.92) v3(42.99,41.67) v3(42.99,39.64) v3(43.04,35.08) v3(43.12,44.92) v3(43.69,31.98) v3(43.69,31.08) v3(43.69,30.17) v3(43.75,37.82) v3(43.75,36.92) v3(43.75,36.01) v3(43.88,42.58) v3(43.88,41.67) v3(43.88,40.55) v3(43.88,39.64) v3(43.94,35.08) v3(43.94,34.19) v3(44.58,31.98) v3(44.58,31.08) v3(44.58,30.17) v3(44.85,35.08) v3(46.07,41.62) v3(46.16,39.14) v3(46.16,38.25) v3(46.47,36.86) v3(46.93,44.28) v3(46.96,42.52) v3(46.96,41.62) v3(46.96,40.71) v3(47.06,39.14) v3(47.06,38.25) v3(47.37,36.86) v3(47.37,35.97) v3(48.28,36.86) v4(42.86,37.82) v4(42.86,36.01) v4(42.99,42.58) v4(42.99,40.55) v4(43.04,34.19) v4(44.01,44.92) v4(44.85,34.19) v4(46.04,44.28) v4(46.07,42.52) v4(46.07,40.71) v4(46.47,35.97) v4(48.28,35.97)
SW2: length 14.4
  Top Layer w0.152: U6.22 41.12,22.67 42.94,22.67 v2(43.05,22.78)
  内层1 w0.152: v2(43.05,22.78) 43.05,22.96 41.77,24.25 33.76,24.25 33.4,24.6 33.4,26.33 v4(33.29,26.44)
  vias: v3(31.48,27.33) v3(32.44,42.44) v3(32.44,41.55) v3(32.45,39.01) v3(32.44,37.74) v3(32.44,36.86) v3(32.38,27.33) v3(32.38,26.44) v3(32.57,44.98) v3(32.57,44.09) v3(33.2,34.64) v3(33.35,42.44) v3(33.35,41.55) v3(33.34,39.91) v3(33.34,39.01) v3(33.35,37.74) v3(33.35,36.86) v3(33.29,27.33) v3(33.47,44.98) v3(33.47,44.09) v3(33.66,30.97) v3(34.07,41.62) v3(34.1,34.64) v3(34.1,33.75) v3(34.55,31.87) v3(34.55,30.97) v3(34.55,30.06) v3(34.73,36.92) v3(34.96,42.52) v3(34.96,40.71) v3(35.01,34.64) v3(35.62,37.82) v3(35.62,36.92) v3(35.62,36.01) v3(35.74,44.98) v3(35.74,44.09) v3(36.5,42.44) v3(36.5,41.55) v3(36.5,40.28) v3(36.5,39.4) v3(36.5,38.13) v3(36.5,37.24) v3(36.65,44.98) v3(36.65,44.09) v3(36.98,40.93) v3(37.41,42.44) v3(37.41,41.55) v3(37.41,40.28) v3(37.41,39.4) v3(37.41,38.13) v3(37.41,37.24) v4(31.48,26.44) v4(32.45,39.91) v4(33.2,33.75) v4(33.66,31.87) v4(33.66,30.06) v4(34.07,42.52) v4(34.07,40.71) v4(34.73,37.82) v4(34.73,36.01) v4(35.01,33.75)
VOUT: length 63.4
  Top Layer w0.152: U6.31 38.12,24.63 37.21,25.53 v2(37.21,26.03)
  内层1 w0.203: 45.77,17.88 50.78,17.88 v4(51.69,18.79) ; 45.77,17.88 45.77,17.54 45.09,16.85 41.78,16.85 41.15,17.49 39.88,17.49 v3(39.37,16.98) ; 45.77,17.88 45.91,18.02 45.91,21.66 v2(45.77,21.81)
  内层1 w0.635: v3(64.52,32.76) 64.52,19.65 63.78,18.92 v4(53.85,18.92) v4(52.83,18.92) 52.7,18.79 v4(51.69,18.79)
  Bottom Layer w0.203: v3(39.37,16.98) 34.42,16.98 33.91,17.49 33.91,19.08 33.91,19.09 33.91,19.55 33.91,19.56 33.91,24.85 35.18,26.12 37.12,26.12 v2(37.21,26.03)
  vias: v3(53.96,42.44) v3(54.23,38.6) v3(54.86,42.44) v3(54.86,41.55) v3(54.99,44.34) v3(55.77,42.44) v3(55.94,39.33) v3(56.39,44.34) v3(56.83,40.24) v3(56.83,39.33) v3(56.83,38.43) v3(56.95,42.32) v3(56.95,41.43) v3(57.83,44.34) v3(57.86,42.32) v3(57.86,41.43) v3(58.6,42.76) v3(58.8,41.69) v3(59.22,44.34) v3(59.38,42.76) v3(60.16,42.76) v3(60.66,44.34) v3(60.94,42.76) v3(61.47,41.69) v3(61.71,42.76) v3(62.23,44.34) v3(62.49,42.76) v3(63.27,42.76) v3(63.75,44.34) v3(64.05,42.76) v3(64.13,41.69) v3(64.44,34.57) v3(64.83,42.76) v3(65.35,34.57) v3(65.28,33.68) v3(65.41,32.63) v3(65.6,42.76) v3(66.48,33.43) v3(66.48,32.54) v3(66.86,44.48) v3(66.86,43.59) v3(67.11,42.32) v3(67.11,41.43) v3(67.11,37.74) v3(67.11,36.86) v3(67.11,35.97) v3(67.38,33.43) v3(67.38,32.54) v3(67.76,44.48) v3(67.76,43.59) v3(68.02,42.32) v3(68.02,41.43) v3(68.02,37.74) v3(68.02,36.86) v3(68.02,35.97) v3(68.46,33.16) v3(69.37,34.25) v3(69.37,33.16) v3(69.37,32.27) v3(69.5,42.76) v3(69.45,41.94) v3(69.47,40.03) v3(69.52,39.01) v3(69.52,38.13) v3(69.65,37.11) v3(69.65,36.22) v3(70.27,33.16) v3(70.36,41.94) v3(70.37,40.92) v3(70.43,39.01) v3(70.43,38.13) v3(70.56,37.11) v3(70.56,36.22) v4(53.96,41.55) v4(55.77,41.55) v4(55.94,40.24) v4(55.94,38.43) v4(59.56,41.69) v4(62.23,41.69) v4(64.44,33.68) v4(64.94,41.69) v4(68.46,32.27) v4(69.45,40.92) v4(70.27,32.27) v4(70.37,40.03)
$1N2476: length 9
  Top Layer w0.152: v3(27.81,31.81) 27.82,31.82 28.81,31.82 28.92,31.71 28.92,25.25 R8.2
  vias: v3(22.54,30.57) v3(22.54,28.66) v3(24.11,31.9) v3(25.02,31.9) v3(25.02,31.01) v3(25.85,28.14) v3(25.92,31.9) v3(26.74,29.05) v3(26.74,28.14) v3(26.74,27.23) v4(24.11,31.01) v4(25.85,29.05) v4(25.85,27.23) v4(25.92,31.01)
$1N2477: length 11.4
  Top Layer w0.152: R9.2 28.96,24.6 29.17,24.82 29.17,30.01 29.2,30.04 29.2,34.01 28.8,34.41 v3(27.81,34.41)
  vias: v3(9.33,41.16) v3(9.33,33.68) v3(9.33,31.78) v3(9.53,37.68) v3(10.03,44.28) v3(10.23,33.68) v3(10.23,32.79) v3(10.23,31.78) v3(10.23,30.89) v3(10.42,35.9) v3(10.54,37.68) v3(10.67,41.9) v3(11.23,31.78) v3(11.74,33.81) v3(12.1,43.59) v3(12.11,36.03) v3(12.14,31.78) v3(12.14,30.89) v3(12.19,39.33) v3(12.64,33.81) v3(12.64,32.92) v3(13.01,43.59) v3(13.01,42.7) v3(13,31.81) v3(13.14,39.33) v3(13.14,35.52) v3(13.91,43.59) v3(13.91,36.3) v3(13.92,32.69) v3(13.9,31.81) v3(13.9,30.92) v3(14.03,40.24) v3(14.03,39.33) v3(14.03,38.43) v3(14.03,35.52) v3(14.41,34.62) v3(15.37,42.32) v3(15.35,41.43) v3(15.75,43.58) v3(15.75,31.36) v3(15.81,36.67) v3(15.81,33.74) v3(16.76,40.67) v3(16.76,39.84) v3(17.67,41.55) v3(18.64,43.58) v3(20.18,41.81) v3(21.08,41.81) v3(21.08,40.92) v3(21.08,40.09) v3(21.53,43.58) v3(21.99,41.81) v3(24.26,40.98) v3(24.42,43.58) v3(25.21,41.04) v3(26.1,41.94) v3(26.1,41.04) v3(26.16,40.09) v3(26.29,35.27) v3(26.92,37.81) v3(27.31,43.58) v3(27.69,39.84) v3(27.88,37.7) v3(27.88,36.79) v3(27.88,35.89) v3(28.51,39.84) v3(28.57,41.75) v3(29.15,36.79) v4(9.13,44.28) v4(9.33,42.07) v4(9.33,40.26) v4(9.33,32.79) v4(9.33,30.89) v4(9.53,38.59) v4(9.53,36.78) v4(10.54,38.59) v4(10.67,43.07) v4(10.67,40.82) v4(10.94,44.28) v4(11.23,30.89) v4(11.3,36.01) v4(11.74,32.92) v4(12.1,42.7) v4(12.19,40.24) v4(12.19,38.43) v4(13.02,36.3) v4(13,30.92) v4(13.14,40.24) v4(13.14,38.43) v4(13.53,34.62) v4(13.91,42.7) v4(14.94,31.42) v4(15.35,40.67) v4(15.35,39.84) v4(15.81,37.52) v4(15.81,34.59) v4(16.62,43.58) v4(17.67,40.67) v4(17.67,39.84) v4(19.4,43.58) v4(20.18,40.92) v4(20.18,40.09) v4(21.99,40.92) v4(21.99,40.09) v4(22.27,43.58) v4(24.26,41.89) v4(24.26,40.08) v4(25.17,43.58) v4(25.21,41.94) v4(25.26,40.09) v4(26.29,39.22) v4(26.29,36.17) v4(26.29,34.36) v4(26.92,36.9) v4(27.67,41.75) v4(27.69,40.75) v4(27.69,38.93) v4(28.1,43.58) v4(28.51,40.75) v4(28.51,38.93) v4(29.15,37.7) v4(29.15,35.89)
$1N2479: length 20.8
  Top Layer w0.152: v3(46.61,23.08) 46.61,23 46.46,22.85 46.15,22.85 46,22.69
  内层1 w0.152: v3(46.61,23.08) 46.61,23.69 46.76,23.84 53.47,23.84 54.23,24.6 v3(54.23,36)
  vias: v3(51.08,31.88) v3(51.16,35.97) v3(51.97,32.79) v3(51.97,31.88) v3(51.97,30.98) v3(52.07,35.97) v3(52.07,35.08) v3(52.98,35.97) v3(55.82,31.08) v3(56.58,35.14) v3(56.58,33.36) v3(56.83,31.98) v3(56.83,31.08) v3(56.83,30.17) v4(51.08,32.79) v4(51.08,30.98) v4(51.16,35.08) v4(52.98,35.08) v4(55.82,31.98) v4(55.82,30.17)
$1N2485: length 2.4
  Top Layer w0.203: 40.13,26.94 40.13,27.39 40.57,27.83 Q18.4
$1N2486: length 8.8
  Top Layer w0.203: Q17.4 38.46,32.87 38.81,32.52 38.81,31.51 39.27,31.05 41.14,31.05 41.28,30.9 41.28,28.72 41.28,28.71 41.28,28.16 40.89,27.78 40.89,26.94
$1N2487: length 9.7
  Top Layer w0.203: R11.1 48.51,26.5 48.89,26.88 Q19.4
$1N2488: length 6.8
  Top Layer w0.203: 30.15,24.29 29.45,24.99 29.45,29.9 29.74,30.19 30.04,30.19 Q16.4
$1N3278: length 3.2
  Top Layer w0.152: R28.1 R31.2 40.13,18.63 39.75,19.01 39.75,20.03 U6.14
$1N3292: length 2.6
  Top Layer w0.152: R26.2 41.02,18.76 40.54,19.24 40.52,19.24 40.24,19.53 40.24,19.54 40.12,19.66 U6.15
$1N3293: length 2.7
  Top Layer w0.203: R24.1 42.49,19.52 40.64,19.52 40.52,19.64 U6.16
$1N3300: length 2.1
  Top Layer w0.152: U6.20 41.12,21.86 41.81,21.86 41.96,21.7 42.91,21.7 C80.1
$1N3307: length 2.4
  Top Layer w0.203: U6.25 41.15,24.06 41.28,23.93 41.28,23.62 U6.24 41.75,23.46 C88.1
$1N3315: length 1.6
  Top Layer w0.152: 38.44,25.62 38.45,25.62 38.52,25.62 U6.30
$1N3321: length 0.9
  Top Layer w0.152: C84.2 41.87,16.93 R26.1
$1N4999: length 8.6
  Top Layer w0.254: Q21.4 59.76,30.7 59.18,30.7 58.8,30.31 58.8,24.98 58.42,24.6 U13.5
$1N5932: length 11.3
  Top Layer w0.254: v3(56.58,27.52) 57.4,27.52 57.78,27.14 57.78,25.62 57.61,25.44 57.02,25.44 U13.6
  内层1 w0.254: v3(56.58,27.52) 58.17,27.52 58.29,27.65 58.29,30.31 58.62,30.64 v3(61.09,30.64)
  vias: v3(63.63,30.67)
$1N6492: length 4.4
  Top Layer w0.406: 14.97,14.08 14.97,11.74 U9.8 ; 14.97,14.08 v3(13.95,14.08) ; 14.97,14.08 v3(15.85,14.08)
$1N9982: length 5.4
  Top Layer w0.635: v4(53.85,16.19) 53.97,16.06 Q15.3 53.71,14.69 52.26,14.69 51.82,15.14 v4(51.82,16.31)
$1N9984: length 2.3
  Top Layer w0.254: Q15.1 53.41,12.03 R49.2 R51.1
$1N10475: length 3.4
  Top Layer w0.254: 31.32,0.93 R52.1 29.53,2.25 Q13.1
$1N12258: length 3.7
  Top Layer w0.254: U13.1 54.54,25.62 54.08,25.62 53.9,25.8 53.9,27.27 54.15,27.52 C87.2
$1N20822: length 6.3
  Top Layer w0.355: CN2.2 23.21,5.55 26.67,5.55 27.04,5.18 Q13.3
$1N55647: length 3.8
  Top Layer w0.254: C103.1 21.46,20.28 20.83,19.65 20.83,18.67 21.04,18.46
$1N55652: length 3.7
  Top Layer w0.254: U15.8 26.54,18.53 26.54,19.9 26.16,20.28 C103.2
$1N55760: length 3.4
  Top Layer w0.254: 27.31,12.84 25.91,12.84 25.91,14.08 U15.5
$1N55864: length 1.8
  Top Layer w0.254: 21.04,14.65 21.04,13.14 R1.2

## Copper pours and planes (outline as drawn; the poured copper is in the pictures)
+5V on Top Layer: 33.4,11.65 34.16,10.88 34.16,9.29 33.88,9.01 27.62,9.01 27.13,9.5 27.13,11.47 27.31,11.65
GND on Top Layer: 22.61,8.85 22.61,2.12 22.86,1.87 59.82,1.87 60.32,2.38 60.32,14 60.45,14.13 63.95,14.13 64.13,14.31 64.13,18 64.01,18.12 56.13,18.12 55.88,17.87 55.88,9.2 55.68,9 22.76,9
GND on 内层1: 22.61,8.85 22.61,2.12 22.86,1.87 59.82,1.87 60.32,2.38 60.32,14 60.45,14.13 63.95,14.13 64.13,14.31 64.13,18 64.01,18.12 56.13,18.12 55.88,17.87 55.88,9.2 55.68,9 22.76,9
GND on 内层1: 22.61,8.85 22.61,2.38 23.11,1.87 59.82,1.87 60.32,2.38 60.32,14 60.45,14.13 63.95,14.13 64.13,14.31 64.13,18 64.01,18.12 56.13,18.12 55.88,17.87 55.88,9.2 55.68,9 22.76,9
PGND on Top Layer: -4.32,52.16 83.44,52.16 83.44,-8.8 -4.32,-8.8
PGND on Bottom Layer: -3.81,53.94 83.95,53.94 83.95,-7.02 -3.81,-7.02
PGND on 内层1: -2.92,55.72 84.84,55.72 84.84,-5.25 -2.92,-5.25
PGND on 内层2: -3.81,56.48 83.95,56.48 83.95,-4.48 -3.81,-4.48
VBUS on Top Layer: 15.63,16.9 19.48,16.9 19.68,17.09 19.68,17.6 19.81,17.73 21.84,17.73 21.97,17.6 21.97,15.7 21.46,15.19 16.62,15.19 16.26,14.82 15.63,15.45
VBUS on Top Layer: 17.27,29.81 17.91,29.17 17.91,27.65 16.89,26.63 16.89,15.45 16.28,14.84 10.3,14.84 9.91,14.44 9.91,8.47 10.29,8.09 11.81,8.09 12.06,7.84 12.06,6.57 11.94,6.44 4.44,6.44 4.19,6.69 4.19,18.27 5.05,19.14 9.39,19.14 9.65,19.39 9.65,26.5 12.95,29.81
VBUS on Bottom Layer: 17.27,29.81 17.91,29.17 17.91,27.65 16.89,26.63 16.89,15.45 16.28,14.84 10.3,14.84 9.91,14.44 9.91,8.47 10.29,8.09 11.81,8.09 12.06,7.84 12.06,6.57 11.94,6.44 4.44,6.44 4.19,6.69 4.19,18.27 5.05,19.14 9.39,19.14 10.16,19.9 10.16,26.25 13.72,29.81
VBUS on Bottom Layer: 17.27,29.81 17.91,29.17 17.91,27.65 16.89,26.63 16.89,15.45 16.28,14.84 10.3,14.84 9.91,14.44 9.91,8.47 10.29,8.09 11.81,8.09 12.06,7.84 12.06,6.57 11.94,6.44 4.44,6.44 4.19,6.69 4.19,18.27 5.05,19.14 9.39,19.14 9.65,19.39 9.65,26.5 12.95,29.81
VBUS on Bottom Layer: 15.64,16.91 19.49,16.91 19.69,17.11 19.69,17.61 19.81,17.74 21.84,17.74 21.97,17.61 21.97,15.71 21.46,15.2 16.63,15.2 16.26,14.84 15.64,15.46
VIN+ on Top Layer: 59.56,29.3 64.01,29.3 64.64,28.66 64.64,22.31 64.13,21.81 59.56,21.81 59.18,22.19 59.18,28.92
VIN+ on Bottom Layer: 59.56,29.3 64.01,29.3 64.64,28.66 64.64,22.31 64.13,21.81 59.56,21.81 59.18,22.19 59.18,28.92
VIN- on Top Layer: 64.9,27.39 70.61,27.39 70.61,22.69 70.1,22.19 66.93,22.19 66.8,22.06 64.85,22.06 64.64,22.27 64.64,27.14
VIN- on Top Layer: 70.41,27.39 73.53,27.39 74.29,26.63 74.29,10.88 73.79,10.38 67.44,10.38 66.93,10.88 66.93,14.95 67.44,15.46 69.47,15.46 69.98,15.96 70.1,15.96 70.1,27.08
VIN- on Bottom Layer: 64.94,27.39 70.66,27.39 70.66,22.69 70.15,22.19 66.97,22.19 66.84,22.06 64.9,22.06 64.69,22.27 64.69,27.14
VIN- on Bottom Layer: 70.41,27.39 73.53,27.39 74.29,26.63 74.29,10.88 73.79,10.38 67.44,10.38 66.93,10.88 66.93,14.95 67.44,15.46 69.47,15.46 69.98,15.96 70.1,15.96 70.1,27.08
SW1 on Top Layer: 41.94,45.81 41.68,45.56 41.68,28.92 42.06,28.54 47.12,28.54 47.4,28.82 47.4,30.57 47.52,30.7 49.3,30.7 49.56,30.95 49.56,45.56 49.3,45.81
SW1 on Top Layer: 41.91,45.81 41.66,45.56 41.66,28.92 42.04,28.54 47.09,28.54 47.37,28.82 47.37,30.57 47.5,30.7 49.28,30.7 49.53,30.95 49.53,45.56 49.28,45.81
SW1 on Bottom Layer: 41.91,45.81 41.66,45.56 41.66,28.92 42.04,28.54 47.09,28.54 47.37,28.82 47.37,30.57 47.5,30.7 49.28,30.7 49.53,30.95 49.53,45.56 49.28,45.81
SW2 on Top Layer: 29.84,25.23 29.34,25.74 29.34,30.44 29.97,31.08 30.99,31.08 31.5,31.59 31.5,45.68 31.75,45.94 37.59,45.94 38.1,45.43 38.1,34.64 36.96,33.49 36.96,28.51 33.68,25.23
SW2 on Bottom Layer: 29.84,25.23 29.34,25.74 29.34,30.44 29.97,31.08 30.99,31.08 31.5,31.59 31.5,45.68 31.75,45.94 37.59,45.94 38.1,45.43 38.1,34.64 36.96,33.49 36.96,28.51 33.68,25.23
VOUT on Top Layer: 50.8,19.77 54.74,19.77 54.86,19.65 54.86,18 54.74,17.87 50.8,17.87 50.67,18 50.67,19.65
VOUT on Top Layer: 71.5,45.43 71.75,45.17 71.75,32.35 71.12,31.71 63.88,31.71 63.5,32.07 63.5,35.14 63.75,35.39 66.17,35.39 66.42,35.65 66.42,40.09 66.17,40.35 57.4,40.35 57.15,40.09 57.15,37.81 56.9,37.55 53.34,37.55 53.09,37.81 53.09,45.17 53.34,45.43
VOUT on Bottom Layer: 71.51,45.43 71.76,45.17 71.76,32.35 71.13,31.71 63.88,31.71 63.51,32.07 63.51,35.14 63.76,35.39 66.17,35.39 66.43,35.65 66.43,40.09 66.17,40.35 57.41,40.35 57.16,40.09 57.16,37.81 56.9,37.55 53.35,37.55 53.09,37.81 53.09,45.17 53.35,45.43
$1N2476 on Top Layer: 22.22,32.6 28.7,32.6 28.96,32.35 28.96,25.62 28.19,24.85 22.48,24.85 21.84,25.49 21.84,32.22
$1N2476 on Bottom Layer: 22.22,32.6 28.7,32.6 28.96,32.35 28.96,25.62 28.19,24.85 22.48,24.85 21.84,25.49 21.84,32.22
$1N2477 on Top Layer: 16.76,30.31 17.02,30.57 17.02,38.82 17.27,39.08 25.15,39.08 25.4,38.82 25.4,33.49 25.65,33.24 29.84,33.24 30.1,33.49 30.1,44.92 29.84,45.17 8.51,45.17 8.25,44.92 8.25,30.57 8.51,30.31
$1N2477 on Bottom Layer: 16.76,30.31 17.02,30.57 17.02,38.82 17.27,39.08 25.15,39.08 25.4,38.82 25.4,33.49 25.65,33.24 29.84,33.24 30.1,33.49 30.1,44.92 29.84,45.17 8.51,45.17 8.25,44.92 8.25,30.57 8.51,30.31
$1N2479 on Top Layer: 57.02,36.92 57.28,36.67 57.28,29.55 57.02,29.3 50.42,29.3 50.16,29.55 50.16,36.67 50.42,36.92
$1N2479 on Bottom Layer: 57.02,36.92 57.28,36.67 57.28,29.55 57.02,29.3 50.42,29.3 50.16,29.55 50.16,36.67 50.42,36.92
$1N5932 on Top Layer: 60.58,35.39 63.25,35.39 63.5,35.14 63.5,32.09 63.88,31.71 64.64,31.71 65.02,31.33 65.02,29.93 64.64,29.55 60.71,29.55 60.45,29.81 60.45,35.27
$1N5932 on Bottom Layer: 60.58,35.39 63.25,35.39 63.5,35.14 63.5,32.09 63.88,31.71 64.64,31.71 65.02,31.33 65.02,29.93 64.64,29.55 60.71,29.55 60.45,29.81 60.45,35.27
$1N6648 on Top Layer: 9.09,6.57 14.22,6.57 14.48,6.31 14.48,4.03 13.97,3.52 8.76,3.52 8.38,3.9 8.38,5.86
$1N55652 on Top Layer: 25.65,18.89 30.35,18.89 30.86,18.38 30.86,15.2 31.12,14.95 32,14.95 32.13,14.82 32.13,13.3 31.88,13.04 28.45,13.04 28.32,13.17 28.32,14.82 28.45,14.95 29.59,14.95 29.84,15.2 29.84,17.74 29.59,18 25.65,18 25.53,18.12 25.53,18.76

Small or netless copper shapes (teardrops, artwork), in the pictures only: 166 on Top Layer, 2 on Bottom Layer, 41 on 内层1
